# EasyEDA Pro project DCDC_Buck_Codex_Fixed_20260618.epro

# Board PCB1
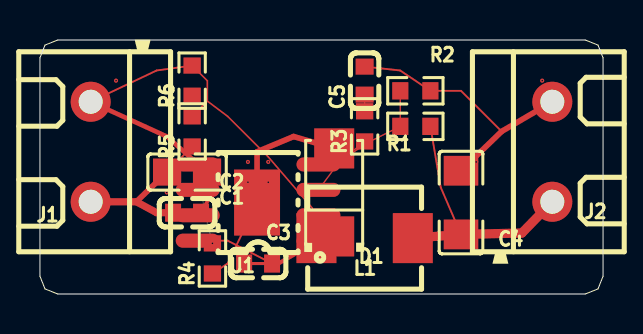
[diagram p0: board, top side]
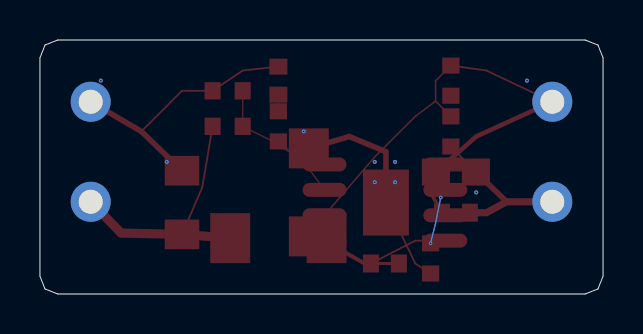
[diagram p1: board, bottom side, seen from below]

Outline 28.19 x 12.7 mm; copper layers: Top Layer, Bottom Layer. Coordinates in mm from the lower left corner of the outline.
Outline path: 0,11.81 0,0.89 0.25,0.25 0.89,0 27.3,0 27.94,0.25 28.19,0.89 28.19,11.81 27.94,12.45 27.3,12.7 0.89,12.7 0.25,12.45 0,11.81
Stack: Top Layer 0.035mm / Dielectric1 1.51mm FR4 er 4.5 / Bottom Layer 0.035mm

## Design rules (mm)
spacing copperThickness1oz (default): track to track 0.102, other pairs 0.152 to 0.3
spacing copperThickness2oz: track to track 0.203, other pairs 0.152 to 0.3
track width copperThickness1oz (default): min 0.127, default 0.254, max 2.54
track width copperThickness2oz: min 0.203, default 0.254, max 2.54
differential pair differentialPair (default): width min 0.127, default 0.254, max 2.54; gap min 0.152, default 0.152

## Placement (name value [footprint] x y rotation side)
C1  -  [C0805]  7.37 6.1 180 top
C2  100nF  [C0603]  7.37 4.06 180 top
C3  -  [C0603]  10.92 1.52 180 top
C4  -  [C1206]  21.08 4.57 270 top
C5  -  [C0603]  16.26 10.67 90 top
D1  SS34  [SMA_L4.3-W2.6-LS5.2-RD]  14.73 5.08 90 top
J1  KF301-2P接线端子  [CONN-TH_XY301V-A-5.0-2P]  2.54 7.11 90 top
J2  KF301-2P接线端子  [CONN-TH_XY301V-A-5.0-2P]  25.65 7.11 270 top
L1  10uH/3A  [IND-SMD_L5.7-W5.1]  16.26 2.79 0 top
R1  -  [R0603]  18.8 8.38 0 top
R2  -  [R0603]  18.8 10.16 180 top
R3  -  [R0603]  16.26 8.38 90 top
R4  -  [R0603]  8.64 1.78 90 top
R5  -  [R0603]  7.62 8.13 90 top
R6  -  [R0603]  7.62 10.67 90 top
U1  MP1584EN  [SOIC-8_L4.9-W3.9-P1.27-LS6.0-BL-EP3.3]  10.92 4.57 90 top

## Footprints (pads in the part's own frame, mm; a bottom-side part is the same pattern mirrored in y, then rotated)
C0603
  rect 0.8x0.9 smd: 1(-0.7,0) 2(0.7,0)
C0805
  rect 1.41x1.35 smd: 1(-1,0) 2(1,0)
C1206
  rect 1.485x1.728 smd: 1(-1.593,0) 2(1.593,0)
CONN-TH_XY301V-A-5.0-2P
  round 2 hole 1.2: 1(-2.5,0) 2(2.5,0)
IND-SMD_L5.7-W5.1
  rect 2x2.5 smd: 1(-2.413,0) 2(2.413,0)
R0603
  rect 0.806x0.864 smd: 1(-0.753,0) 2(0.753,0)
SMA_L4.3-W2.6-LS5.2-RD
  rect 2x2 smd: 1(-2.2,0) 2(2.2,0)
SOIC-8_L4.9-W3.9-P1.27-LS6.0-BL-EP3.3
  oval 0.7x2.2 smd: 1(-1.905,-3.022) 2(-0.635,-3.022) 3(0.635,-3.022) 4(1.905,-3.022) 5(1.905,3.022) 6(0.635,3.022) 7(-0.635,3.022) 8(-1.905,3.022)
  rect 3.3x2.3 smd: 9(0,0.051)

## Nets
GND: C1.1 C2.1 C4.1 C5.1 D1.2 J1.2 J2.1 R2.1 R4.1 R6.1 U1.5 U1.9
VIN: C1.2 C2.2 J1.1 R5.1 U1.7
BST: C3.1 U1.8
COMP: R3.1 U1.3
COMP_RC: C5.2 R3.2
EN: R5.2 R6.2 U1.2
FB: R1.1 R2.2 U1.4
FREQ: R4.2 U1.6
SW: C3.2 D1.1 L1.1 U1.1
VOUT: C4.2 J2.2 L1.2 R1.2

## Via types
v1: diameter 0.203, hole 0.089, Top Layer to Bottom Layer, 9 vias
v2: diameter 0.191, hole 0.089, Top Layer to Bottom Layer, 2 vias

## Routing (per net, layer and track width the routed paths; a pad name or vN(x,y) marks a point on that pad's centre or on a via; arc(x,y) is an arc through that point)
GND: length 39.8
  Top Layer w0.089: 23.11,8.13 21.08,10.16 R2.1 18.03,11.18 16.26,11.37 ; R4.1 9.4,1.52 10.87,4.57 ; 7.62,11.42 5.84,11.18 J1.2
  Top Layer w0.178: C2.1 8.64,5.08 7.9,6.48
  Top Layer w0.229: C1.1 6.35,7.87 J1.2
  Top Layer w0.28: J2.1 23.11,8.13 C4.1 ; D1.2 12.7,7.87 10.87,7.11 10.87,4.57
  vias: v1(3.81,10.67) v1(6.35,5.08) v1(10.41,6.6) v1(10.41,5.59) v1(11.43,6.6) v1(11.43,5.59) v1(14.99,8.13) v1(21.84,6.6) v1(25.15,10.67)
VIN: length 9.4
  Top Layer w0.089: C1.2 R5.1
  Top Layer w0.28: 4.83,4.61 C1.2
  Top Layer w0.305: U1.7 7.37,3.94 C2.2
  Top Layer w0.355: J1.1 4.83,4.61 5.84,4.06 C2.2
BST: length 4
  Top Layer w0.089: U1.8 9.4,2.67 C3.1
COMP: length 3.4
  Top Layer w0.064: U1.3 14.99,6.6 R3.1
COMP_RC: length 0.8
  Top Layer w0.064: R3.2 16.26,9.97
EN: length 11.2
  Top Layer w0.076: U1.2 11.43,6.86 9.4,8.88 8.38,9.64 ; R6.2 8.38,10.66 8.38,9.64 ; 8.38,9.64 R5.2
FB: length 6.4
  Top Layer w0.064: 13.94,6.48 14.73,6.48 16.51,7.62 R1.1 R2.2
FREQ: length 2.8
  Top Layer w0.064: U1.6 v2(8.13,4.83)
  Bottom Layer w0.064: v2(8.13,4.83) 8.38,3.56 v2(8.64,2.53)
SW: length 5
  Top Layer w0.152: C3.2 11.94,1.52
  Top Layer w0.203: 11.94,1.52 U1.1
  Top Layer w0.457: D1.1 U1.1 L1.1
VOUT: length 13.3
  Top Layer w0.089: R1.2 20.07,5.33 C4.2
  Top Layer w0.457: L1.2 C4.2 24.13,3.05 J2.2

## Copper pours and planes (outline as drawn; the poured copper is in the pictures)
GND on Top Layer: -3.1,22.55 26.31,22.55 26.31,16.38 -3.1,16.38
GND on Bottom Layer: -1.7,24.21 27.71,24.21 27.71,18.03 -1.7,18.03
